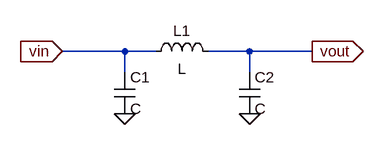
[diagram p0: schematic omatch.asc]
omatch.asc, the LTspice schematic file:
Version 4
SHEET 1 880 680
WIRE 112 272 16 272
WIRE 160 272 112 272
WIRE 304 272 240 272
WIRE 400 272 304 272
WIRE 112 304 112 272
WIRE 304 304 304 272
FLAG 112 368 0
FLAG 304 368 0
FLAG 16 272 vin
IOPIN 16 272 In
FLAG 400 272 vout
IOPIN 400 272 Out
SYMBOL ind 144 288 R270
WINDOW 0 32 56 VTop 2
WINDOW 3 5 56 VBottom 2
SYMATTR InstName L1
SYMBOL cap 96 304 R0
SYMATTR InstName C1
SYMBOL cap 288 304 R0
SYMATTR InstName C2

The netlist it stands for:
* omatch.asc
L1 vin vout L
C1 vin 0 C
C2 vout 0 C
.backanno
.end